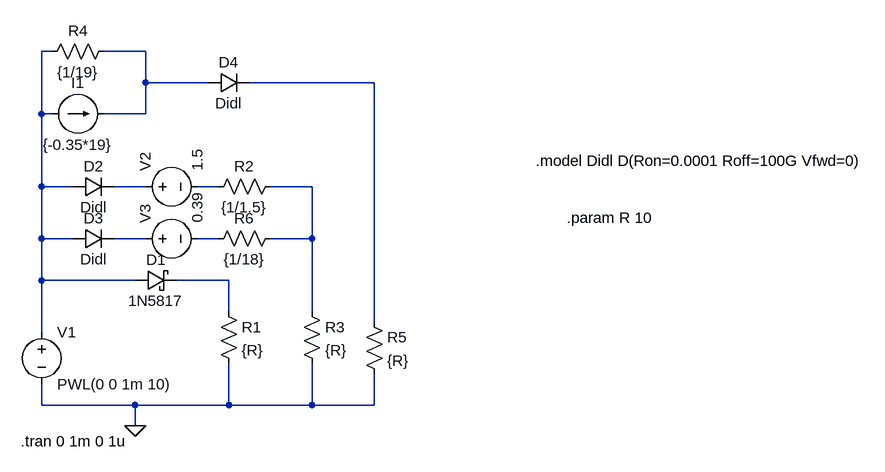
[diagram p0: schematic linear_diode.asc]
linear_diode.asc, the LTspice schematic file:
Version 4
SHEET 1 1344 680
WIRE 80 -256 64 -256
WIRE 224 -256 160 -256
WIRE 224 -208 224 -256
WIRE 320 -208 224 -208
WIRE 576 -208 384 -208
WIRE 64 -160 64 -256
WIRE 80 -160 64 -160
WIRE 224 -160 224 -208
WIRE 224 -160 160 -160
WIRE 64 -48 64 -160
WIRE 112 -48 64 -48
WIRE 224 -48 176 -48
WIRE 336 -48 304 -48
WIRE 480 -48 416 -48
WIRE 64 32 64 -48
WIRE 112 32 64 32
WIRE 224 32 176 32
WIRE 336 32 304 32
WIRE 480 32 480 -48
WIRE 480 32 416 32
WIRE 64 96 64 32
WIRE 208 96 64 96
WIRE 352 96 272 96
WIRE 352 144 352 96
WIRE 480 144 480 32
WIRE 576 160 576 -208
WIRE 64 176 64 96
WIRE 64 288 64 256
WIRE 208 288 64 288
WIRE 352 288 352 224
WIRE 352 288 208 288
WIRE 480 288 480 224
WIRE 480 288 352 288
WIRE 576 288 576 240
WIRE 576 288 480 288
WIRE 208 320 208 288
FLAG 208 320 0
SYMBOL schottky 208 112 R270
WINDOW 0 32 32 VTop 2
WINDOW 3 0 32 VBottom 2
SYMATTR InstName D1
SYMATTR Value 1N5817
SYMATTR Description Diode
SYMATTR Type diode
SYMBOL voltage 64 160 R0
WINDOW 123 0 0 Left 2
WINDOW 39 0 0 Left 2
SYMATTR InstName V1
SYMATTR Value PWL(0 0 1m 10)
SYMBOL res 336 128 R0
SYMATTR InstName R1
SYMATTR Value {R}
SYMBOL res 320 -32 R270
WINDOW 0 32 56 VTop 2
WINDOW 3 0 56 VBottom 2
SYMATTR InstName R2
SYMATTR Value {1/1.5}
SYMBOL voltage 208 -48 R270
WINDOW 123 0 0 Left 2
WINDOW 39 0 0 Left 2
SYMATTR InstName V2
SYMATTR Value 1.5
SYMBOL res 464 128 R0
SYMATTR InstName R3
SYMATTR Value {R}
SYMBOL res 64 -240 R270
WINDOW 0 32 56 VTop 2
WINDOW 3 0 56 VBottom 2
SYMATTR InstName R4
SYMATTR Value {1/19}
SYMBOL res 560 144 R0
SYMATTR InstName R5
SYMATTR Value {R}
SYMBOL current 80 -160 R270
WINDOW 0 32 40 VTop 2
WINDOW 3 -32 40 VBottom 2
WINDOW 123 0 0 Left 2
WINDOW 39 0 0 Left 2
SYMATTR InstName I1
SYMATTR Value {-0.35*19}
SYMBOL voltage 208 32 R270
WINDOW 123 0 0 Left 2
WINDOW 39 0 0 Left 2
SYMATTR InstName V3
SYMATTR Value 0.39
SYMBOL res 320 48 R270
WINDOW 0 32 56 VTop 2
WINDOW 3 0 56 VBottom 2
SYMATTR InstName R6
SYMATTR Value {1/18}
SYMBOL diode 112 -32 R270
WINDOW 0 32 32 VTop 2
WINDOW 3 0 32 VBottom 2
SYMATTR InstName D2
SYMATTR Value Didl
SYMBOL diode 112 48 R270
WINDOW 0 32 32 VTop 2
WINDOW 3 0 32 VBottom 2
SYMATTR InstName D3
SYMATTR Value Didl
SYMBOL diode 320 -192 R270
WINDOW 0 32 32 VTop 2
WINDOW 3 0 32 VBottom 2
SYMATTR InstName D4
SYMATTR Value Didl
TEXT 32 344 Left 2 !.tran 0 1m 0 1u
TEXT 824 -88 Left 2 !.model Didl D(Ron=0.0001 Roff=100G Vfwd=0)
TEXT 872 0 Left 2 !.param R 10

The netlist it stands for:
* linear_diode.asc
D1 N001 N009 1N5817
V1 N001 0 PWL(0 0 1m 10)
R1 N009 0 {R}
R2 N005 N006 {1/1.5}
V2 N004 N005 1.5
R3 N006 0 {R}
R4 N001 N002 {1/19}
R5 N003 0 {R}
I1 N001 N002 {-0.35*19}
V3 N007 N008 0.39
R6 N008 N006 {1/18}
D2 N001 N004 Didl
D3 N001 N007 Didl
D4 N002 N003 Didl
.model D D
.lib standard.dio
.tran 0 1m 0 1u
.model Didl D(Ron=0.0001 Roff=100G Vfwd=0)
.param R 10
.backanno
.end